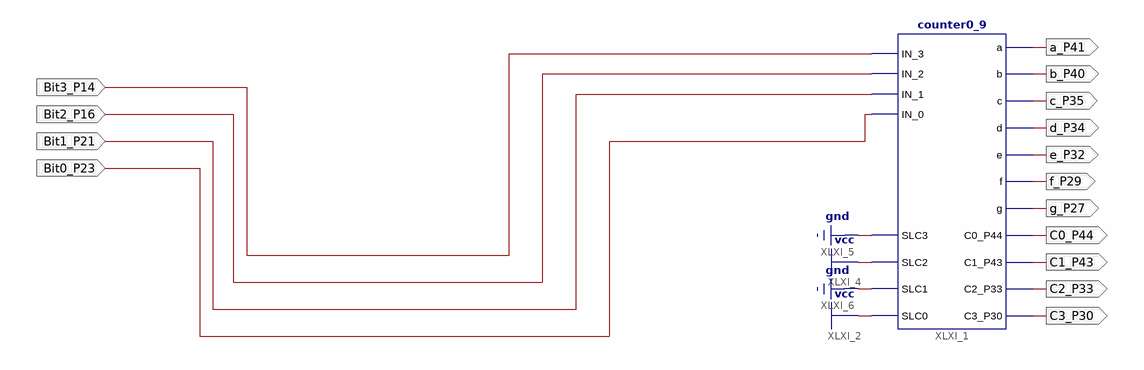
[diagram p0: schematic sheet 1]
// Xilinx ISE schematic BCD_LED.sch (spartan6) as structural Verilog: 1 symbols, 15 ports
module BCD_LED (
  input  Bit2_P16,
  input  Bit1_P21,
  input  Bit0_P23,
  input  Bit3_P14,
  output a_P41,
  output b_P40,
  output c_P35,
  output d_P34,
  output e_P32,
  output f_P29,
  output g_P27,
  output C0_P44,
  output C1_P43,
  output C2_P33,
  output C3_P30
);

  counter0_9 XLXI_1 (
    .a(a_P41), .b(b_P40), .c(c_P35), .d(d_P34), .e(e_P32), .f(f_P29), .g(g_P27), .C0_P44(C0_P44),
    .C1_P43(C1_P43), .C2_P33(C2_P33), .C3_P30(C3_P30), .IN_3(Bit3_P14), .IN_2(Bit2_P16), .IN_1(Bit1_P21),
    .IN_0(Bit0_P23), .SLC0(1'b1), .SLC2(1'b1), .SLC3(1'b0), .SLC1(1'b0));
endmodule
